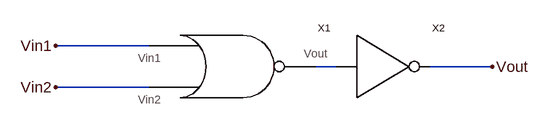
[diagram p0: schematic OR_2.asc]
OR_2.asc, the LTspice schematic file:
Version 4
SHEET 1 880 680
WIRE 112 128 -32 128
WIRE 400 160 368 160
WIRE 640 160 544 160
WIRE 112 192 -32 192
FLAG -32 128 Vin1
FLAG -32 192 Vin2
FLAG 640 160 Vout
SYMBOL inverter 432 160 R0
SYMATTR InstName X2
SYMBOL NOR_2 160 160 R0
SYMATTR InstName X1

The netlist it stands for:
* OR_2.asc
XX2 N001 Vout inverter  ; pins Vin Vout
XX1 Vin1 Vin2 N001 NOR_2  ; pins Vin1 Vin2 Vout
.backanno
.end